# Altium schematic sheet PROB_S7CAS_FPGA_B02.SchDoc
size Tabloid; SheetNumber: 5; SheetTotal: 14; Sheet_Name: Insert name in Document Parameters; Size: 11x17
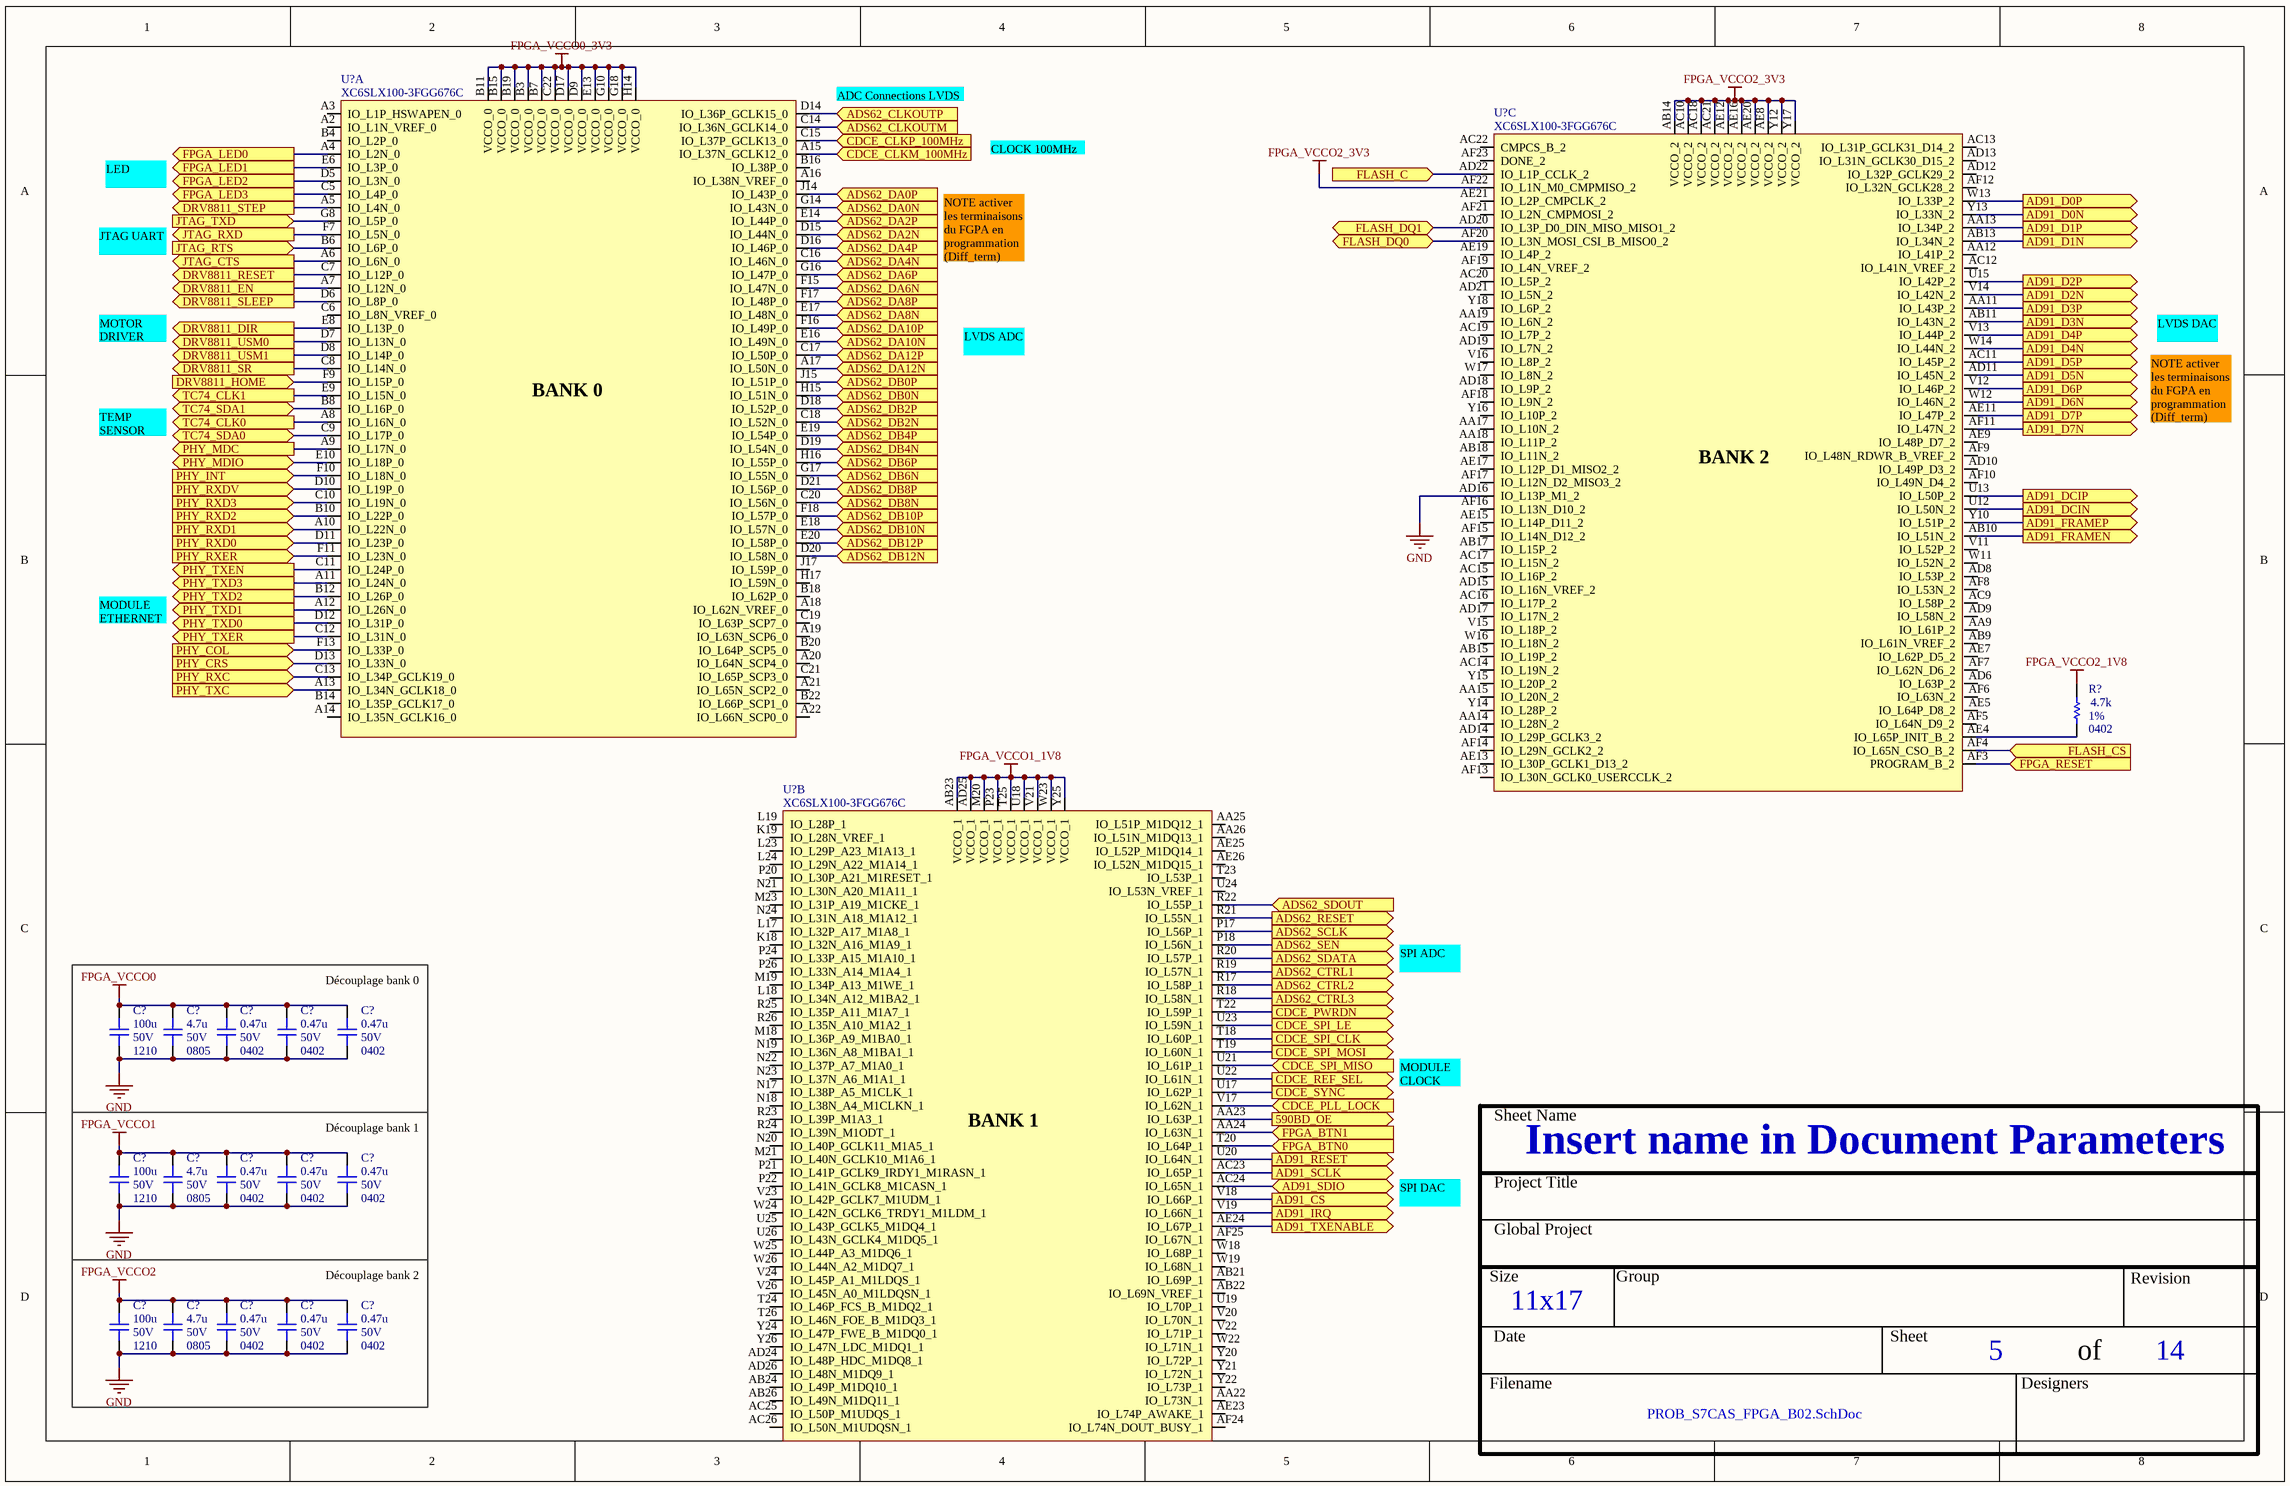
[diagram p0: PROB_S7CAS_FPGA_B02.SchDoc]

## Parts
(Parts that share a designator on the sheet are numbered #1, #2 ... from top to bottom, then left to right.)
C?#1  value 100u  Voltage: 50V  Package: 1210  [CAP_1210]  (hidden comment: CAP - 1210)
C?#2  value 4.7u  Voltage: 50V  Package: 0805  [CAP_0805]  (hidden comment: CAP - 0805)
C?#3  value 0.47u  Voltage: 50V  Package: 0402  [CAP_0402]  (hidden comment: CAP - 0402)
C?#4  value 0.47u  Voltage: 50V  Package: 0402  [CAP_0402]  (hidden comment: CAP - 0402)
C?#5  value 0.47u  Voltage: 50V  Package: 0402  [CAP_0402]  (hidden comment: CAP - 0402)
C?#6  value 100u  Voltage: 50V  Package: 1210  [CAP_1210]  (hidden comment: CAP - 1210)
C?#7  value 4.7u  Voltage: 50V  Package: 0805  [CAP_0805]  (hidden comment: CAP - 0805)
C?#8  value 0.47u  Voltage: 50V  Package: 0402  [CAP_0402]  (hidden comment: CAP - 0402)
C?#9  value 0.47u  Voltage: 50V  Package: 0402  [CAP_0402]  (hidden comment: CAP - 0402)
C?#10  value 0.47u  Voltage: 50V  Package: 0402  [CAP_0402]  (hidden comment: CAP - 0402)
C?#11  value 100u  Voltage: 50V  Package: 1210  [CAP_1210]  (hidden comment: CAP - 1210)
C?#12  value 4.7u  Voltage: 50V  Package: 0805  [CAP_0805]  (hidden comment: CAP - 0805)
C?#13  value 0.47u  Voltage: 50V  Package: 0402  [CAP_0402]  (hidden comment: CAP - 0402)
C?#14  value 0.47u  Voltage: 50V  Package: 0402  [CAP_0402]  (hidden comment: CAP - 0402)
C?#15  value 0.47u  Voltage: 50V  Package: 0402  [CAP_0402]  (hidden comment: CAP - 0402)
R?  value 4.7k  Package: 0402  Precision: 1%  [RES_0402]  (hidden comment: RES - 0402)
U?#1  XC6SLX100-3FGG676C  [FPGA_XILINX_FGG676]  (part A of 10)
U?#2  XC6SLX100-3FGG676C  [FPGA_XILINX_FGG676]  (part C of 10)
U?#3  XC6SLX100-3FGG676C  [FPGA_XILINX_FGG676]  (part B of 10)

## Ports
590BD_OE (out), AD91_CS (out), AD91_D0N (out), AD91_D0P (out), AD91_D1N (out), AD91_D1P (out), AD91_D2N (out), AD91_D2P (out), AD91_D3N (out), AD91_D3P (out), AD91_D4N (out), AD91_D4P (out), AD91_D5N (out), AD91_D5P (out), AD91_D6N (out), AD91_D6P (out), AD91_D7N (out), AD91_D7P (out), AD91_DCIN (out), AD91_DCIP (out), AD91_FRAMEN (out), AD91_FRAMEP (out), AD91_IRQ (out), AD91_RESET (out), AD91_SCLK (out), AD91_SDIO (bidir), AD91_TXENABLE (out), ADS62_CLKOUTM (in), ADS62_CLKOUTP (in), ADS62_CTRL1 (out), ADS62_CTRL2 (out), ADS62_CTRL3 (out), ADS62_DA0N (in), ADS62_DA0P (in), ADS62_DA2N (in), ADS62_DA2P (in), ADS62_DA4N (in), ADS62_DA4P (in), ADS62_DA6N (in), ADS62_DA6P (in), ADS62_DA8N (in), ADS62_DA8P (in), ADS62_DA10N (in), ADS62_DA10P (in), ADS62_DA12N (in), ADS62_DA12P (in), ADS62_DB0N (in), ADS62_DB0P (in), ADS62_DB2N (in), ADS62_DB2P (in), ADS62_DB4N (in), ADS62_DB4P (in), ADS62_DB6N (in), ADS62_DB6P (in), ADS62_DB8N (in), ADS62_DB8P (in), ADS62_DB10N (in), ADS62_DB10P (in), ADS62_DB12N (in), ADS62_DB12P (in), ADS62_RESET (out), ADS62_SCLK (out), ADS62_SDATA (out), ADS62_SDOUT (in), ADS62_SEN (out), CDCE_CLKM_100MHz (in), CDCE_CLKP_100MHz (in), CDCE_PLL_LOCK (in), CDCE_PWRDN (out), CDCE_REF_SEL (out), CDCE_SPI_CLK (out), CDCE_SPI_LE (out), CDCE_SPI_MISO (in), CDCE_SPI_MOSI (out), CDCE_SYNC (out), DRV8811_DIR (out), DRV8811_EN (out), DRV8811_HOME (in), DRV8811_RESET (out), DRV8811_SLEEP (out), DRV8811_SR (out), DRV8811_STEP (out), DRV8811_USM0 (out), DRV8811_USM1 (out), FLASH_C (in), FLASH_CS (in), FLASH_DQ0 (bidir), FLASH_DQ1 (bidir), FPGA_BTN0 (in), FPGA_BTN1 (in), FPGA_LED0 (out), FPGA_LED1 (out), FPGA_LED2 (out), FPGA_LED3 (out), FPGA_RESET (in), JTAG_CTS (out), JTAG_RTS (in), JTAG_RXD (out), JTAG_TXD (in), PHY_COL (in), PHY_CRS (in), PHY_INT (in), PHY_MDC (out), PHY_MDIO (bidir), PHY_RXC (in), PHY_RXD0 (in), PHY_RXD1 (in), PHY_RXD2 (in), PHY_RXD3 (in), PHY_RXDV (in), PHY_RXER (in), PHY_TXC (in), PHY_TXD0 (out), PHY_TXD1 (out), PHY_TXD2 (out), PHY_TXD3 (out), PHY_TXEN (out), PHY_TXER (out), TC74_CLK0 (out), TC74_CLK1 (out), TC74_SDA0 (bidir), TC74_SDA1 (bidir)

## Nets
FPGA_VCCO0: C?#1.2 C?#2.2 C?#3.2 C?#4.2 C?#5.2
FPGA_VCCO0_3V3: U?#1.B3(VCCO_0) U?#1.B7(VCCO_0) U?#1.B11(VCCO_0) U?#1.B15(VCCO_0) U?#1.B19(VCCO_0) U?#1.C22(VCCO_0) U?#1.D9(VCCO_0) U?#1.D17(VCCO_0) U?#1.E13(VCCO_0) U?#1.G10(VCCO_0) U?#1.G18(VCCO_0) U?#1.H14(VCCO_0)
FPGA_VCCO1: C?#6.2 C?#7.2 C?#8.2 C?#9.2 C?#10.2
FPGA_VCCO1_1V8: U?#3.AB23(VCCO_1) U?#3.AD25(VCCO_1) U?#3.M20(VCCO_1) U?#3.P23(VCCO_1) U?#3.T25(VCCO_1) U?#3.U18(VCCO_1) U?#3.V21(VCCO_1) U?#3.W23(VCCO_1) U?#3.Y25(VCCO_1)
FPGA_VCCO2: C?#11.2 C?#12.2 C?#13.2 C?#14.2 C?#15.2
FPGA_VCCO2_1V8: R?.2
FPGA_VCCO2_3V3: U?#2.AB14(VCCO_2) U?#2.AC10(VCCO_2) U?#2.AC18(VCCO_2) U?#2.AC21(VCCO_2) U?#2.AE8(VCCO_2) U?#2.AE12(VCCO_2) U?#2.AE16(VCCO_2) U?#2.AE20(VCCO_2) U?#2.AF22(IO_L1N_M0_CMPMISO_2) U?#2.Y12(VCCO_2) U?#2.Y17(VCCO_2)
GND: C?#1.1 C?#2.1 C?#3.1 C?#4.1 C?#5.1 C?#6.1 C?#7.1 C?#8.1 C?#9.1 C?#10.1 C?#11.1 C?#12.1 C?#13.1 C?#14.1 C?#15.1 U?#2.AD16(IO_L13P_M1_2)
590BD_OE: U?#3.AA23(IO_L63P_1) ; port 590BD_OE
AD91_CS: U?#3.V18(IO_L66P_1) ; port AD91_CS
AD91_D0N: U?#2.Y13(IO_L33N_2) ; port AD91_D0N
AD91_D0P: U?#2.W13(IO_L33P_2) ; port AD91_D0P
AD91_D1N: U?#2.AB13(IO_L34N_2) ; port AD91_D1N
AD91_D1P: U?#2.AA13(IO_L34P_2) ; port AD91_D1P
AD91_D2N: U?#2.V14(IO_L42N_2) ; port AD91_D2N
AD91_D2P: U?#2.U15(IO_L42P_2) ; port AD91_D2P
AD91_D3N: U?#2.AB11(IO_L43N_2) ; port AD91_D3N
AD91_D3P: U?#2.AA11(IO_L43P_2) ; port AD91_D3P
AD91_D4N: U?#2.W14(IO_L44N_2) ; port AD91_D4N
AD91_D4P: U?#2.V13(IO_L44P_2) ; port AD91_D4P
AD91_D5N: U?#2.AD11(IO_L45N_2) ; port AD91_D5N
AD91_D5P: U?#2.AC11(IO_L45P_2) ; port AD91_D5P
AD91_D6N: U?#2.W12(IO_L46N_2) ; port AD91_D6N
AD91_D6P: U?#2.V12(IO_L46P_2) ; port AD91_D6P
AD91_D7N: U?#2.AF11(IO_L47N_2) ; port AD91_D7N
AD91_D7P: U?#2.AE11(IO_L47P_2) ; port AD91_D7P
AD91_DCIN: U?#2.U12(IO_L50N_2) ; port AD91_DCIN
AD91_DCIP: U?#2.U13(IO_L50P_2) ; port AD91_DCIP
AD91_FRAMEN: U?#2.AB10(IO_L51N_2) ; port AD91_FRAMEN
AD91_FRAMEP: U?#2.Y10(IO_L51P_2) ; port AD91_FRAMEP
AD91_IRQ: U?#3.V19(IO_L66N_1) ; port AD91_IRQ
AD91_RESET: U?#3.U20(IO_L64N_1) ; port AD91_RESET
AD91_SCLK: U?#3.AC23(IO_L65P_1) ; port AD91_SCLK
AD91_SDIO: U?#3.AC24(IO_L65N_1) ; port AD91_SDIO
AD91_TXENABLE: U?#3.AE24(IO_L67P_1) ; port AD91_TXENABLE
ADS62_CLKOUTM: U?#1.C14(IO_L36N_GCLK14_0) ; port ADS62_CLKOUTM
ADS62_CLKOUTP: U?#1.D14(IO_L36P_GCLK15_0) ; port ADS62_CLKOUTP
ADS62_CTRL1: U?#3.R19(IO_L57N_1) ; port ADS62_CTRL1
ADS62_CTRL2: U?#3.R17(IO_L58P_1) ; port ADS62_CTRL2
ADS62_CTRL3: U?#3.R18(IO_L58N_1) ; port ADS62_CTRL3
ADS62_DA0N: U?#1.G14(IO_L43N_0) ; port ADS62_DA0N
ADS62_DA0P: U?#1.J14(IO_L43P_0) ; port ADS62_DA0P
ADS62_DA2N: U?#1.D15(IO_L44N_0) ; port ADS62_DA2N
ADS62_DA2P: U?#1.E14(IO_L44P_0) ; port ADS62_DA2P
ADS62_DA4N: U?#1.C16(IO_L46N_0) ; port ADS62_DA4N
ADS62_DA4P: U?#1.D16(IO_L46P_0) ; port ADS62_DA4P
ADS62_DA6N: U?#1.F15(IO_L47N_0) ; port ADS62_DA6N
ADS62_DA6P: U?#1.G16(IO_L47P_0) ; port ADS62_DA6P
ADS62_DA8N: U?#1.E17(IO_L48N_0) ; port ADS62_DA8N
ADS62_DA8P: U?#1.F17(IO_L48P_0) ; port ADS62_DA8P
ADS62_DA10N: U?#1.E16(IO_L49N_0) ; port ADS62_DA10N
ADS62_DA10P: U?#1.F16(IO_L49P_0) ; port ADS62_DA10P
ADS62_DA12N: U?#1.A17(IO_L50N_0) ; port ADS62_DA12N
ADS62_DA12P: U?#1.C17(IO_L50P_0) ; port ADS62_DA12P
ADS62_DB0N: U?#1.H15(IO_L51N_0) ; port ADS62_DB0N
ADS62_DB0P: U?#1.J15(IO_L51P_0) ; port ADS62_DB0P
ADS62_DB2N: U?#1.C18(IO_L52N_0) ; port ADS62_DB2N
ADS62_DB2P: U?#1.D18(IO_L52P_0) ; port ADS62_DB2P
ADS62_DB4N: U?#1.D19(IO_L54N_0) ; port ADS62_DB4N
ADS62_DB4P: U?#1.E19(IO_L54P_0) ; port ADS62_DB4P
ADS62_DB6N: U?#1.G17(IO_L55N_0) ; port ADS62_DB6N
ADS62_DB6P: U?#1.H16(IO_L55P_0) ; port ADS62_DB6P
ADS62_DB8N: U?#1.C20(IO_L56N_0) ; port ADS62_DB8N
ADS62_DB8P: U?#1.D21(IO_L56P_0) ; port ADS62_DB8P
ADS62_DB10N: U?#1.E18(IO_L57N_0) ; port ADS62_DB10N
ADS62_DB10P: U?#1.F18(IO_L57P_0) ; port ADS62_DB10P
ADS62_DB12N: U?#1.D20(IO_L58N_0) ; port ADS62_DB12N
ADS62_DB12P: U?#1.E20(IO_L58P_0) ; port ADS62_DB12P
ADS62_RESET: U?#3.R21(IO_L55N_1) ; port ADS62_RESET
ADS62_SCLK: U?#3.P17(IO_L56P_1) ; port ADS62_SCLK
ADS62_SDATA: U?#3.R20(IO_L57P_1) ; port ADS62_SDATA
ADS62_SDOUT: U?#3.R22(IO_L55P_1) ; port ADS62_SDOUT
ADS62_SEN: U?#3.P18(IO_L56N_1) ; port ADS62_SEN
CDCE_CLKM_100MHz: U?#1.A15(IO_L37N_GCLK12_0) ; port CDCE_CLKM_100MHz
CDCE_CLKP_100MHz: U?#1.C15(IO_L37P_GCLK13_0) ; port CDCE_CLKP_100MHz
CDCE_PLL_LOCK: U?#3.V17(IO_L62N_1) ; port CDCE_PLL_LOCK
CDCE_PWRDN: U?#3.T22(IO_L59P_1) ; port CDCE_PWRDN
CDCE_REF_SEL: U?#3.U22(IO_L61N_1) ; port CDCE_REF_SEL
CDCE_SPI_CLK: U?#3.T18(IO_L60P_1) ; port CDCE_SPI_CLK
CDCE_SPI_LE: U?#3.U23(IO_L59N_1) ; port CDCE_SPI_LE
CDCE_SPI_MISO: U?#3.U21(IO_L61P_1) ; port CDCE_SPI_MISO
CDCE_SPI_MOSI: U?#3.T19(IO_L60N_1) ; port CDCE_SPI_MOSI
CDCE_SYNC: U?#3.U17(IO_L62P_1) ; port CDCE_SYNC
DRV8811_DIR: U?#1.E8(IO_L13P_0) ; port DRV8811_DIR
DRV8811_EN: U?#1.A7(IO_L12N_0) ; port DRV8811_EN
DRV8811_HOME: U?#1.F9(IO_L15P_0) ; port DRV8811_HOME
DRV8811_RESET: U?#1.C7(IO_L12P_0) ; port DRV8811_RESET
DRV8811_SLEEP: U?#1.D6(IO_L8P_0) ; port DRV8811_SLEEP
DRV8811_SR: U?#1.C8(IO_L14N_0) ; port DRV8811_SR
DRV8811_STEP: U?#1.A5(IO_L4N_0) ; port DRV8811_STEP
DRV8811_USM0: U?#1.D7(IO_L13N_0) ; port DRV8811_USM0
DRV8811_USM1: U?#1.D8(IO_L14P_0) ; port DRV8811_USM1
FLASH_C: U?#2.AD22(IO_L1P_CCLK_2) ; port FLASH_C
FLASH_CS: U?#2.AF4(IO_L65N_CSO_B_2) ; port FLASH_CS
FLASH_DQ0: U?#2.AF20(IO_L3N_MOSI_CSI_B_MISO0_2) ; port FLASH_DQ0
FLASH_DQ1: U?#2.AD20(IO_L3P_D0_DIN_MISO_MISO1_2) ; port FLASH_DQ1
FPGA_BTN0: U?#3.T20(IO_L64P_1) ; port FPGA_BTN0
FPGA_BTN1: U?#3.AA24(IO_L63N_1) ; port FPGA_BTN1
FPGA_LED0: U?#1.A4(IO_L2N_0) ; port FPGA_LED0
FPGA_LED1: U?#1.E6(IO_L3P_0) ; port FPGA_LED1
FPGA_LED2: U?#1.D5(IO_L3N_0) ; port FPGA_LED2
FPGA_LED3: U?#1.C5(IO_L4P_0) ; port FPGA_LED3
FPGA_RESET: U?#2.AF3(PROGRAM_B_2) ; port FPGA_RESET
JTAG_CTS: U?#1.A6(IO_L6N_0) ; port JTAG_CTS
JTAG_RTS: U?#1.B6(IO_L6P_0) ; port JTAG_RTS
JTAG_RXD: U?#1.F7(IO_L5N_0) ; port JTAG_RXD
JTAG_TXD: U?#1.G8(IO_L5P_0) ; port JTAG_TXD
PHY_COL: U?#1.F13(IO_L33P_0) ; port PHY_COL
PHY_CRS: U?#1.D13(IO_L33N_0) ; port PHY_CRS
PHY_INT: U?#1.F10(IO_L18N_0) ; port PHY_INT
PHY_MDC: U?#1.A9(IO_L17N_0) ; port PHY_MDC
PHY_MDIO: U?#1.E10(IO_L18P_0) ; port PHY_MDIO
PHY_RXC: U?#1.C13(IO_L34P_GCLK19_0) ; port PHY_RXC
PHY_RXD0: U?#1.D11(IO_L23P_0) ; port PHY_RXD0
PHY_RXD1: U?#1.A10(IO_L22N_0) ; port PHY_RXD1
PHY_RXD2: U?#1.B10(IO_L22P_0) ; port PHY_RXD2
PHY_RXD3: U?#1.C10(IO_L19N_0) ; port PHY_RXD3
PHY_RXDV: U?#1.D10(IO_L19P_0) ; port PHY_RXDV
PHY_RXER: U?#1.F11(IO_L23N_0) ; port PHY_RXER
PHY_TXC: U?#1.A13(IO_L34N_GCLK18_0) ; port PHY_TXC
PHY_TXD0: U?#1.D12(IO_L31P_0) ; port PHY_TXD0
PHY_TXD1: U?#1.A12(IO_L26N_0) ; port PHY_TXD1
PHY_TXD2: U?#1.B12(IO_L26P_0) ; port PHY_TXD2
PHY_TXD3: U?#1.A11(IO_L24N_0) ; port PHY_TXD3
PHY_TXEN: U?#1.C11(IO_L24P_0) ; port PHY_TXEN
PHY_TXER: U?#1.C12(IO_L31N_0) ; port PHY_TXER
TC74_CLK0: U?#1.A8(IO_L16N_0) ; port TC74_CLK0
TC74_CLK1: U?#1.E9(IO_L15N_0) ; port TC74_CLK1
TC74_SDA0: U?#1.C9(IO_L17P_0) ; port TC74_SDA0
TC74_SDA1: U?#1.B8(IO_L16P_0) ; port TC74_SDA1
NetR?_1: R?.1 U?#2.AE4(IO_L65P_INIT_B_2)

Not connected (* = marked no-connect by the designer): U?#1 A2(IO_L1N_VREF_0) A3(IO_L1P_HSWAPEN_0) A14(IO_L35N_GCLK16_0) A16(IO_L38N_VREF_0) A18(IO_L62N_VREF_0) A19(IO_L63N_SCP6_0) A20(IO_L64N_SCP4_0) A21(IO_L65N_SCP2_0) A22(IO_L66N_SCP0_0) B4(IO_L2P_0) B14(IO_L35P_GCLK17_0) B16(IO_L38P_0) B18(IO_L62P_0) B20(IO_L64P_SCP5_0) B22(IO_L66P_SCP1_0) C6(IO_L8N_VREF_0) C19(IO_L63P_SCP7_0) C21(IO_L65P_SCP3_0) H17(IO_L59N_0) J17(IO_L59P_0); U?#2 AA9(IO_L61P_2) AA12(IO_L41P_2) AA14(IO_L28N_2) AA15(IO_L20N_2) AA17(IO_L10N_2) AA18(IO_L11P_2) AA19(IO_L6N_2) AB9(IO_L61N_VREF_2) AB15(IO_L19P_2) AB17(IO_L15P_2) AB18(IO_L11N_2) AC9(IO_L58P_2) AC12(IO_L41N_VREF_2) AC13(IO_L31P_GCLK31_D14_2) AC14(IO_L19N_2) AC15(IO_L16P_2) AC16(IO_L17P_2) AC17(IO_L15N_2) AC19(IO_L7P_2) AC20(IO_L5P_2) AC22(CMPCS_B_2) AD6(IO_L63P_2) AD8(IO_L53P_2) AD9(IO_L58N_2) AD10(IO_L49P_D3_2) AD12(IO_L32P_GCLK29_2) AD13(IO_L31N_GCLK30_D15_2) AD14(IO_L29P_GCLK3_2) AD15(IO_L16N_VREF_2) AD17(IO_L17N_2) AD18(IO_L9P_2) AD19(IO_L7N_2) AD21(IO_L5N_2) AE5(IO_L64P_D8_2) AE7(IO_L62P_D5_2) AE9(IO_L48P_D7_2) AE13(IO_L30P_GCLK1_D13_2) AE15(IO_L14P_D11_2) AE17(IO_L12P_D1_MISO2_2) AE19(IO_L4P_2) AE21(IO_L2P_CMPCLK_2) AF5(IO_L64N_D9_2) AF6(IO_L63N_2) AF7(IO_L62N_D6_2) AF8(IO_L53N_2) AF9(IO_L48N_RDWR_B_VREF_2) AF10(IO_L49N_D4_2) AF12(IO_L32N_GCLK28_2) AF13(IO_L30N_GCLK0_USERCCLK_2) AF14(IO_L29N_GCLK2_2) AF15(IO_L14N_D12_2) AF16(IO_L13N_D10_2) AF17(IO_L12N_D2_MISO3_2) AF18(IO_L9N_2) AF19(IO_L4N_VREF_2) AF21(IO_L2N_CMPMOSI_2) AF23(DONE_2) V11(IO_L52P_2) V15(IO_L18P_2) V16(IO_L8P_2) W11(IO_L52N_2) W16(IO_L18N_2) W17(IO_L8N_2) Y14(IO_L28P_2) Y15(IO_L20P_2) Y16(IO_L10P_2) Y18(IO_L6P_2); U?#3 AA22(IO_L73N_1) AA25(IO_L51P_M1DQ12_1) AA26(IO_L51N_M1DQ13_1) AB21(IO_L69P_1) AB22(IO_L69N_VREF_1) AB24(IO_L49P_M1DQ10_1) AB26(IO_L49N_M1DQ11_1) AC25(IO_L50P_M1UDQS_1) AC26(IO_L50N_M1UDQSN_1) AD24(IO_L48P_HDC_M1DQ8_1) AD26(IO_L48N_M1DQ9_1) AE23(IO_L74P_AWAKE_1) AE25(IO_L52P_M1DQ14_1) AE26(IO_L52N_M1DQ15_1) AF24(IO_L74N_DOUT_BUSY_1) AF25(IO_L67N_1) K18(IO_L32N_A16_M1A9_1) K19(IO_L28N_VREF_1) L17(IO_L32P_A17_M1A8_1) L18(IO_L34N_A12_M1BA2_1) L19(IO_L28P_1) L23(IO_L29P_A23_M1A13_1) L24(IO_L29N_A22_M1A14_1) M18(IO_L36P_A9_M1BA0_1) M19(IO_L34P_A13_M1WE_1) M21(IO_L40N_GCLK10_M1A6_1) M23(IO_L31P_A19_M1CKE_1) N17(IO_L38P_A5_M1CLK_1) N18(IO_L38N_A4_M1CLKN_1) N19(IO_L36N_A8_M1BA1_1) N20(IO_L40P_GCLK11_M1A5_1) N21(IO_L30N_A20_M1A11_1) N22(IO_L37P_A7_M1A0_1) N23(IO_L37N_A6_M1A1_1) N24(IO_L31N_A18_M1A12_1) P20(IO_L30P_A21_M1RESET_1) P21(IO_L41P_GCLK9_IRDY1_M1RASN_1) P22(IO_L41N_GCLK8_M1CASN_1) P24(IO_L33P_A15_M1A10_1) P26(IO_L33N_A14_M1A4_1) R23(IO_L39P_M1A3_1) R24(IO_L39N_M1ODT_1) R25(IO_L35P_A11_M1A7_1) R26(IO_L35N_A10_M1A2_1) T23(IO_L53P_1) T24(IO_L46P_FCS_B_M1DQ2_1) T26(IO_L46N_FOE_B_M1DQ3_1) U19(IO_L70P_1) U24(IO_L53N_VREF_1) U25(IO_L43P_GCLK5_M1DQ4_1) U26(IO_L43N_GCLK4_M1DQ5_1) V20(IO_L70N_1) V22(IO_L71P_1) V23(IO_L42P_GCLK7_M1UDM_1) V24(IO_L45P_A1_M1LDQS_1) V26(IO_L45N_A0_M1LDQSN_1) W18(IO_L68P_1) W19(IO_L68N_1) W22(IO_L71N_1) W24(IO_L42N_GCLK6_TRDY1_M1LDM_1) W25(IO_L44P_A3_M1DQ6_1) W26(IO_L44N_A2_M1DQ7_1) Y20(IO_L72P_1) Y21(IO_L72N_1) Y22(IO_L73P_1) Y24(IO_L47P_FWE_B_M1DQ0_1) Y26(IO_L47N_LDC_M1DQ1_1)

## Notes on the sheet
- (near U?#1) ADC Connections LVDS
- CLOCK 100MHz
- LED
- JTAG UART
- NOTE activer les terminaisons du FGPA en programmation (Diff_term)
- MOTOR DRIVER
- LVDS ADC
- LVDS DAC
- TEMP SENSOR
- MODULE ETHERNET
- SPI ADC
- (near C?#4) Découplage bank 0
- MODULE CLOCK
- (near C?#9) Découplage bank 1
- SPI DAC
- (near C?#14) Découplage bank 2
- Sheet Name
- Project Title
- Global Project
- Size
- Group
- Revision
- Date
- Sheet
- of
- Filename
- Designers
- (in symbol FPGA_XC6SLX100-3FGG676C, part A) BANK 0
- (in symbol FPGA_XC6SLX100-3FGG676C, part B) BANK 1
- (in symbol FPGA_XC6SLX100-3FGG676C, part C) BANK 2

## Library data of the parts
C?#1 C?#6 C?#11 = CAP - 1210: Precision: 10%; Current: *; CreatedBy: Jonathan Bouchard
C?#2 C?#7 C?#12 = CAP - 0805: Precision: 10%; Current: *; CreatedBy: Jonathan Bouchard; Power: *
C?#3-C?#5 C?#8-C?#10 C?#13-C?#15 = CAP - 0402: Precision: 10%; Current: *; CreatedBy: Jonathan Bouchard; Power: *
R? = RES - 0402: Voltage: 50V; Power: 1/16W; Current: *; CreatedBy: Jonathan Bouchard
U?#1-U?#3 = FPGA_XC6SLX100-3FGG676C: FPGA - XILINX SPARTAN 6 480 I/O - BGA-676; Voltage: 1.14 V ~ 1.26 V; Current: *; Power: *; Mfg: Xilinx; Mfg Part Number: XC6SLX100-3FGG676C; HelpURL: https://www.xilinx.com/support/documentation/data_sheets/ds162.pdf; CreatedBy: Jonathan Bouchard; Temperature: 0°C ~ 85°C (TJ); Value: *; Precision: *; Package: BGA-676; Supplier 1: Digikey; Supplier Part Number 1: 122-1760-ND